# Altium schematic sheet CON_PWR_RJ45.SchDoc: CAN Connector DB9 Male
size A4; Organization: Altium Limited.; Address1: Level 3, 12a Rodborough Rd; Address2: Frenchs Forest 2086; Address3: NSW; Address4: AUSTRALIA; Revision: 6; SheetNumber: 51; SheetTotal: 64
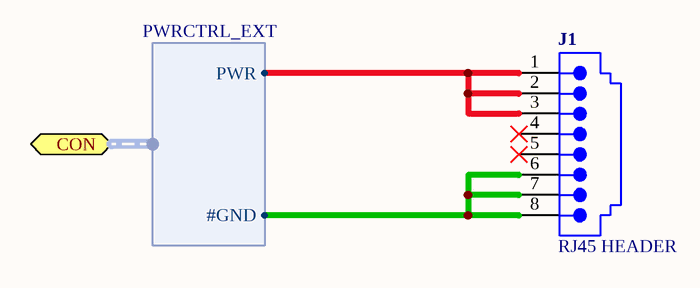
[diagram p0: CON_PWR_RJ45.SchDoc]

## Parts
J1  RJ45 HEADER  [15-43-6233]

## Ports
CON (harness PWRCTRL_EXT)

## Harnesses
PWRCTRL_EXT: PWR, #GND

## Nets
NetJ1_1: J1.1 J1.2 J1.3 ; port CON.PWR
NetJ1_6: J1.6 J1.7 J1.8 ; port CON.#GND

Not connected (* = marked no-connect by the designer): J1 4* 5*

## Notes on the sheet
- Sheet Title
- Project Title
- Size:
- Date:
- A4
- Assy:
- Time:
- Sheet
- Revision:
- of
- File:

## Library data of the parts
J1 = D-300-0005: Connector, RJ45 Socket, Right-Angle, 8 Way (Ethernet), PCM8P8C; Category: Connector; Connector type: RJ45 HEADER; Status: Production